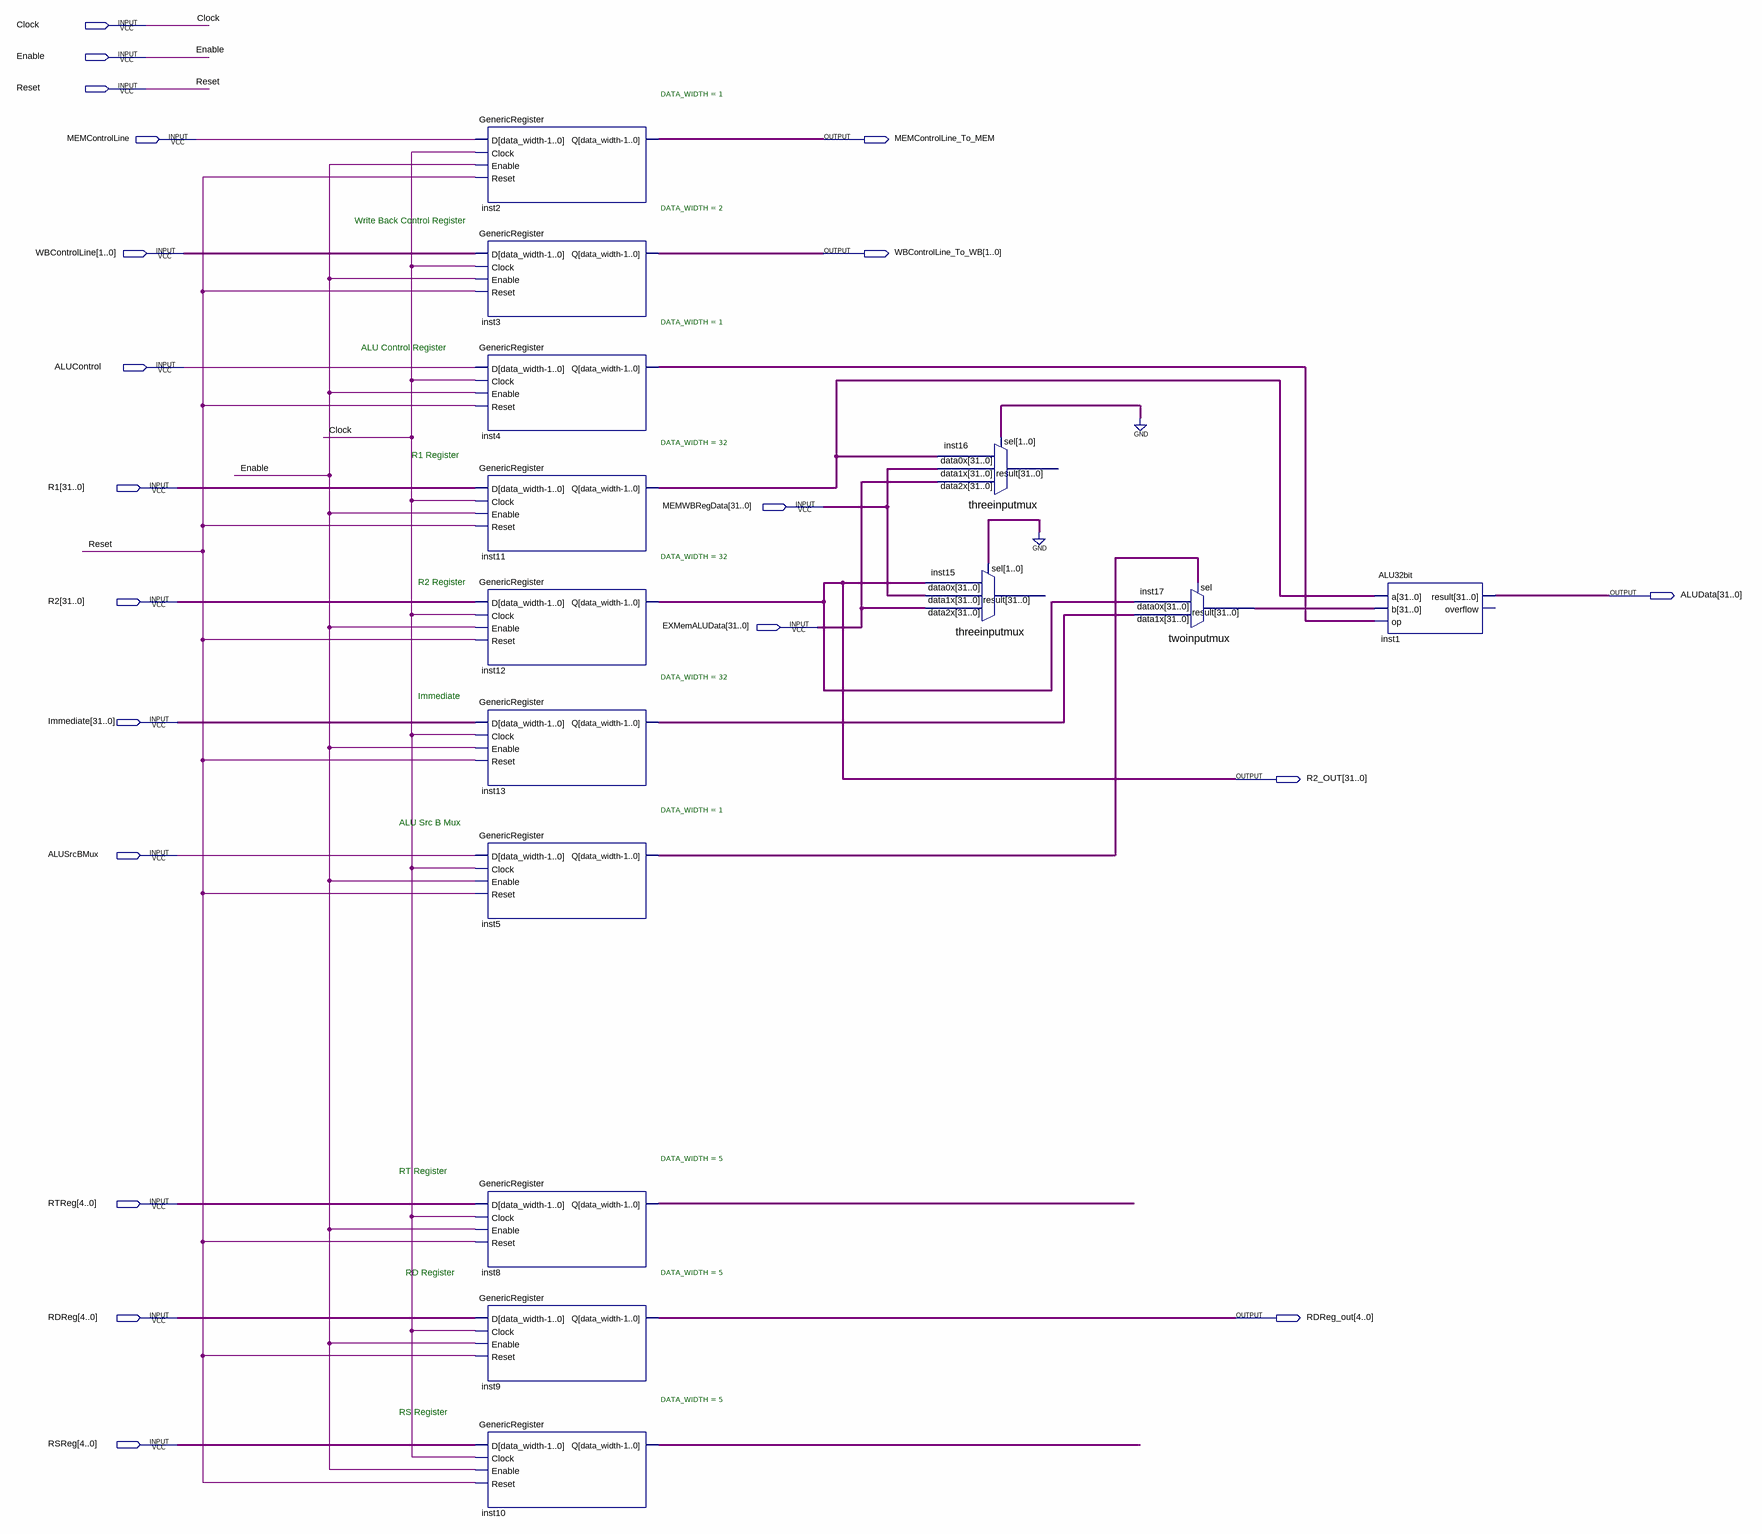
[diagram p0: schematic sheet]
// Quartus schematic Execution_Stage.bdf as structural Verilog: 14 symbols, 20 pins
module Execution_Stage (
  input  Clock,
  input  Enable,
  input  Reset,
  input  MEMControlLine,
  input  [1:0] WBControlLine,
  input  ALUControl,
  input  [31:0] R1,
  input  [31:0] MEMWBRegData,
  input  [31:0] R2,
  input  [31:0] EXMemALUData,
  input  [31:0] Immediate,
  input  ALUSrcBMux,
  input  [4:0] RTReg,
  input  [4:0] RDReg,
  input  [4:0] RSReg,
  output MEMControlLine_To_MEM,
  output [1:0] WBControlLine_To_WB,
  output [31:0] ALUData,
  output [31:0] R2_OUT,
  output [4:0] RDReg_out
);

  wire inst4_q, inst5_q;
  wire [4:0] inst8_q, inst10_q;
  wire [31:0] inst11_q, inst13_q, inst17_result;

  GenericRegister #(.DATA_WIDTH(1)) inst2 (
    .D(MEMControlLine), .Clock(Clock), .Enable(Enable), .Reset(Reset), .Q(MEMControlLine_To_MEM));
  GenericRegister #(.DATA_WIDTH(2)) inst3 (
    .D(WBControlLine), .Clock(Clock), .Enable(Enable), .Reset(Reset), .Q(WBControlLine_To_WB));
  GenericRegister #(.DATA_WIDTH(1)) inst4 (.D(ALUControl), .Clock(Clock), .Enable(Enable), .Reset(Reset), .Q(inst4_q));
  GenericRegister #(.DATA_WIDTH(32)) inst11 (.D(R1), .Clock(Clock), .Enable(Enable), .Reset(Reset), .Q(inst11_q));
  GenericRegister #(.DATA_WIDTH(32)) inst12 (.D(R2), .Clock(Clock), .Enable(Enable), .Reset(Reset), .Q(R2_OUT));
  GenericRegister #(.DATA_WIDTH(32)) inst13 (
    .D(Immediate), .Clock(Clock), .Enable(Enable), .Reset(Reset), .Q(inst13_q));
  GenericRegister #(.DATA_WIDTH(1)) inst5 (.D(ALUSrcBMux), .Clock(Clock), .Enable(Enable), .Reset(Reset), .Q(inst5_q));
  GenericRegister #(.DATA_WIDTH(5)) inst8 (.D(RTReg), .Clock(Clock), .Enable(Enable), .Reset(Reset), .Q(inst8_q));
  GenericRegister #(.DATA_WIDTH(5)) inst9 (.D(RDReg), .Clock(Clock), .Enable(Enable), .Reset(Reset), .Q(RDReg_out));
  GenericRegister #(.DATA_WIDTH(5)) inst10 (.D(RSReg), .Clock(Clock), .Enable(Enable), .Reset(Reset), .Q(inst10_q));
  threeinputmux inst16 (.data2x(EXMemALUData), .data1x(MEMWBRegData), .data0x(inst11_q), .sel(2'b00));  // open: result
  threeinputmux inst15 (.data2x(EXMemALUData), .data1x(MEMWBRegData), .data0x(R2_OUT), .sel(2'b00));  // open: result
  twoinputmux inst17 (.data1x(inst13_q), .data0x(R2_OUT), .sel(inst5_q), .result(inst17_result));
  ALU32bit inst1 (.a(inst11_q), .b(inst17_result), .op(inst4_q), .result(ALUData));  // open: overflow

  // Notes on the sheet:
  //   Write Back Control Register
  //   ALU Control Register
  //   R1 Register
  //   R2 Register
  //   Immediate
  //   ALU Src B Mux
  //   RT Register
  //   RD Register
  //   RS Register
endmodule
